# Altium schematic sheet USB_TYPE_C.SchDoc
size A4
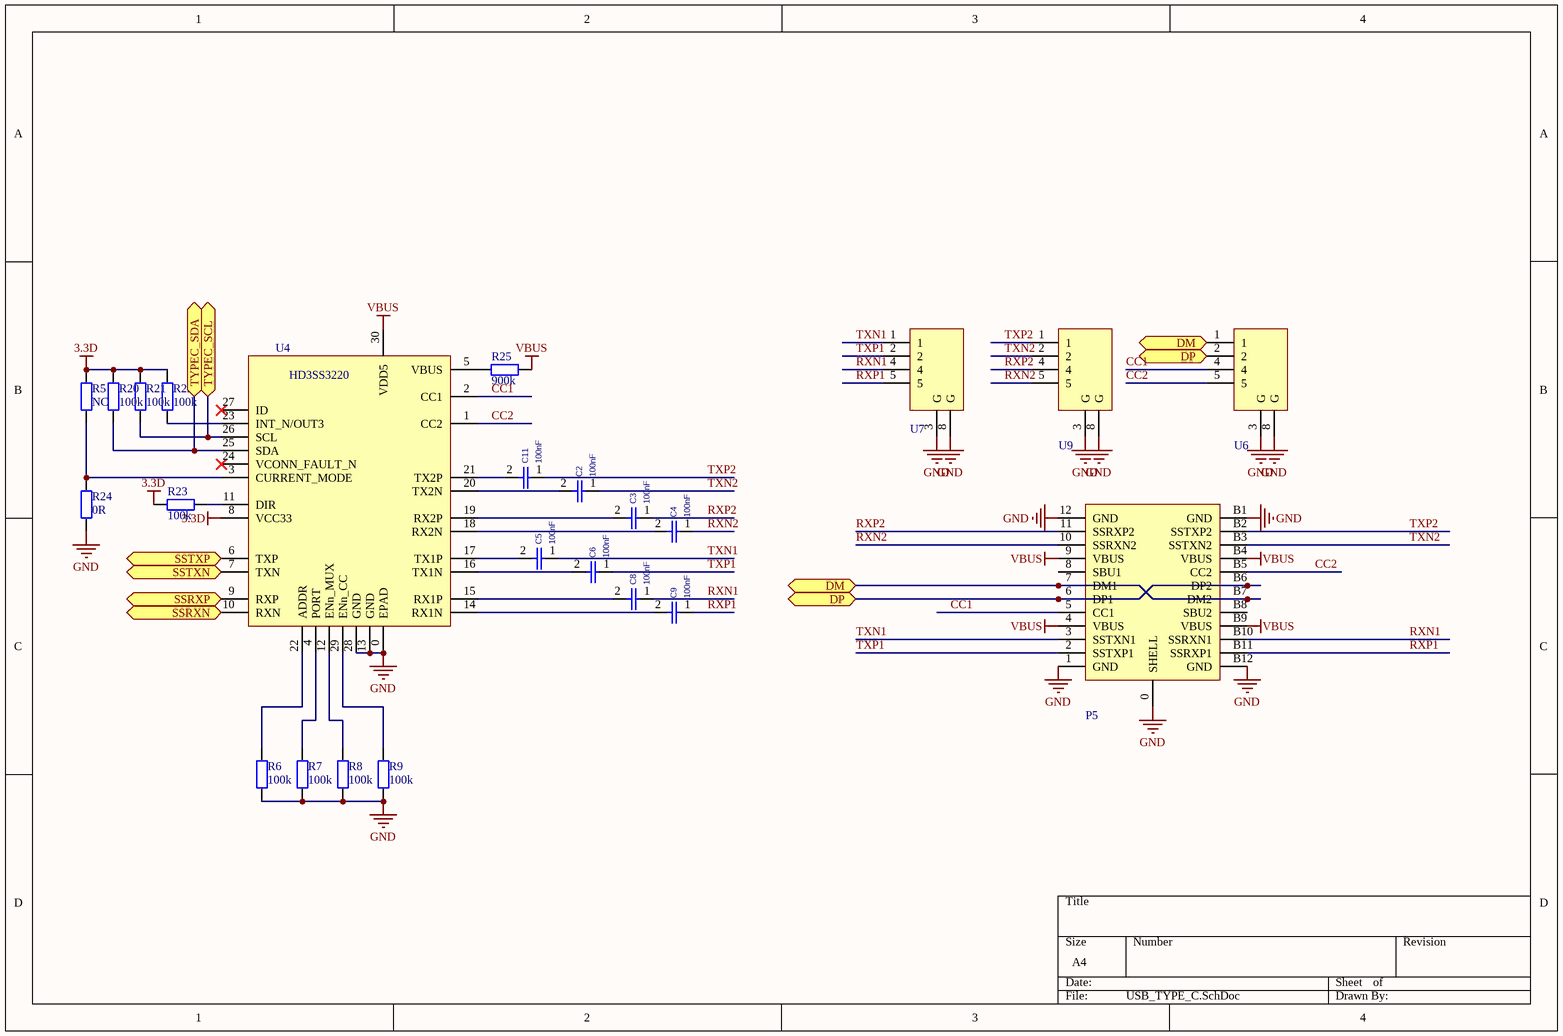
[diagram p0: USB_TYPE_C.SchDoc]

## Parts
C2  100nF  [0201]
C3  100nF  [0201]
C4  100nF  [0201]
C5  100nF  [0201]
C6  100nF  [0201]
C8  100nF  [0201]
C9  100nF  [0201]
C11  100nF  [0201]
P5  TYPEC  [TYPEC]  (value not drawn)
R5  NC  [0201]
R6  100k  [0201]
R7  100k  [0201]
R8  100k  [0201]
R9  100k  [0201]
R20  100k  [0201]
R21  100k  [0201]
R22  100k  [0201]
R23  100k  [0201]
R24  0R  [0201]
R25  900k  [0201]
U4  HD3SS3220  [HD3SS3220]
U6  PUSB3FR4  [PUSB3FR4]  (value not drawn)
U7  PUSB3FR4  [PUSB3FR4]  (value not drawn)
U9  PUSB3FR4  [PUSB3FR4]  (value not drawn)

## Ports
DM, DP, SSRXN, SSRXP, SSTXN, SSTXP, TYPEC_SCL, TYPEC_SDA

## Nets
3.3D: R5.2 R20.2 R21.2 R22.2 R23.1 U4.8(VCC33)
GND: P5.0(SHELL) P5.1(GND) P5.12(GND) P5.B1(GND) P5.B12(GND) R6.1 R7.1 R8.1 R9.1 R24.1 U4.0(EPAD) U4.13(GND) U4.28(GND) U6.3(G) U6.8(G) U7.3(G) U7.8(G) U9.3(G) U9.8(G)
VBUS: P5.4(VBUS) P5.9(VBUS) P5.B4(VBUS) P5.B9(VBUS) R25.2 U4.30(VDD5)
CC1: P5.5(CC1) U4.2(CC1) U6.4
CC2: P5.B5(CC2) U4.1(CC2) U6.5
DM: P5.7(DM1) P5.B7(DM2) U6.1 ; port DM
DP: P5.6(DP1) P5.B6(DP2) U6.2 ; port DP
RXN1: C8.1 P5.B10(SSRXN1) U7.4
RXN2: C4.1 P5.10(SSRXN2) U9.5
RXP1: C9.1 P5.B11(SSRXP1) U7.5
RXP2: C3.1 P5.11(SSRXP2) U9.4
SSRXN: U4.10(RXN) ; port SSRXN
SSRXP: U4.9(RXP) ; port SSRXP
SSTXN: U4.7(TXN) ; port SSTXN
SSTXP: U4.6(TXP) ; port SSTXP
TXN1: C5.1 P5.3(SSTXN1) U7.1
TXN2: C2.1 P5.B3(SSTXN2) U9.2
TXP1: C6.1 P5.2(SSTXP1) U7.2
TXP2: C11.1 P5.B2(SSTXP2) U9.1
TYPEC_SCL: R21.1 U4.26(SCL) ; port TYPEC_SCL
TYPEC_SDA: R20.1 U4.25(SDA) ; port TYPEC_SDA
NetC2_2: C2.2 U4.20(TX2N)
NetC3_2: C3.2 U4.19(RX2P)
NetC4_2: C4.2 U4.18(RX2N)
NetC5_2: C5.2 U4.17(TX1P)
NetC6_2: C6.2 U4.16(TX1N)
NetC8_2: C8.2 U4.15(RX1P)
NetC9_2: C9.2 U4.14(RX1N)
NetC11_2: C11.2 U4.21(TX2P)
NetR5_1: R5.1 R24.2 U4.3(CURRENT_MODE)
NetR6_2: R6.2 U4.22(ADDR)
NetR7_2: R7.2 U4.4(PORT)
NetR8_2: R8.2 U4.12(ENn_MUX)
NetR9_2: R9.2 U4.29(ENn_CC)
NetR22_1: R22.1 U4.23(INT_N/OUT3)
NetR23_2: R23.2 U4.11(DIR)
NetR25_1: R25.1 U4.5(VBUS)

Not connected (* = marked no-connect by the designer): P5 8(SBU1) B8(SBU2); U4 24(VCONN_FAULT_N)* 27(ID)*

## Library data of the parts
C2-C6 C8 C9 C11 = CAP/0402: 1st Part Field: 0402
R5-R9 R20-R25 = Res2: Resistor; Published: 8-Jun-2000; LatestRevisionDate: 17-Jul-2002; LatestRevisionNote: Re-released for DXP Platform.; PackageReference: AXIAL-0.4; Publisher: Altium Limited; PackageDescription: Axial Device, Thru-Hole; 2 Leads; 0.4 in Pin Spacing